# EAGLE design Lemming_SMD_2_2 (EAGLE 9.5.2)
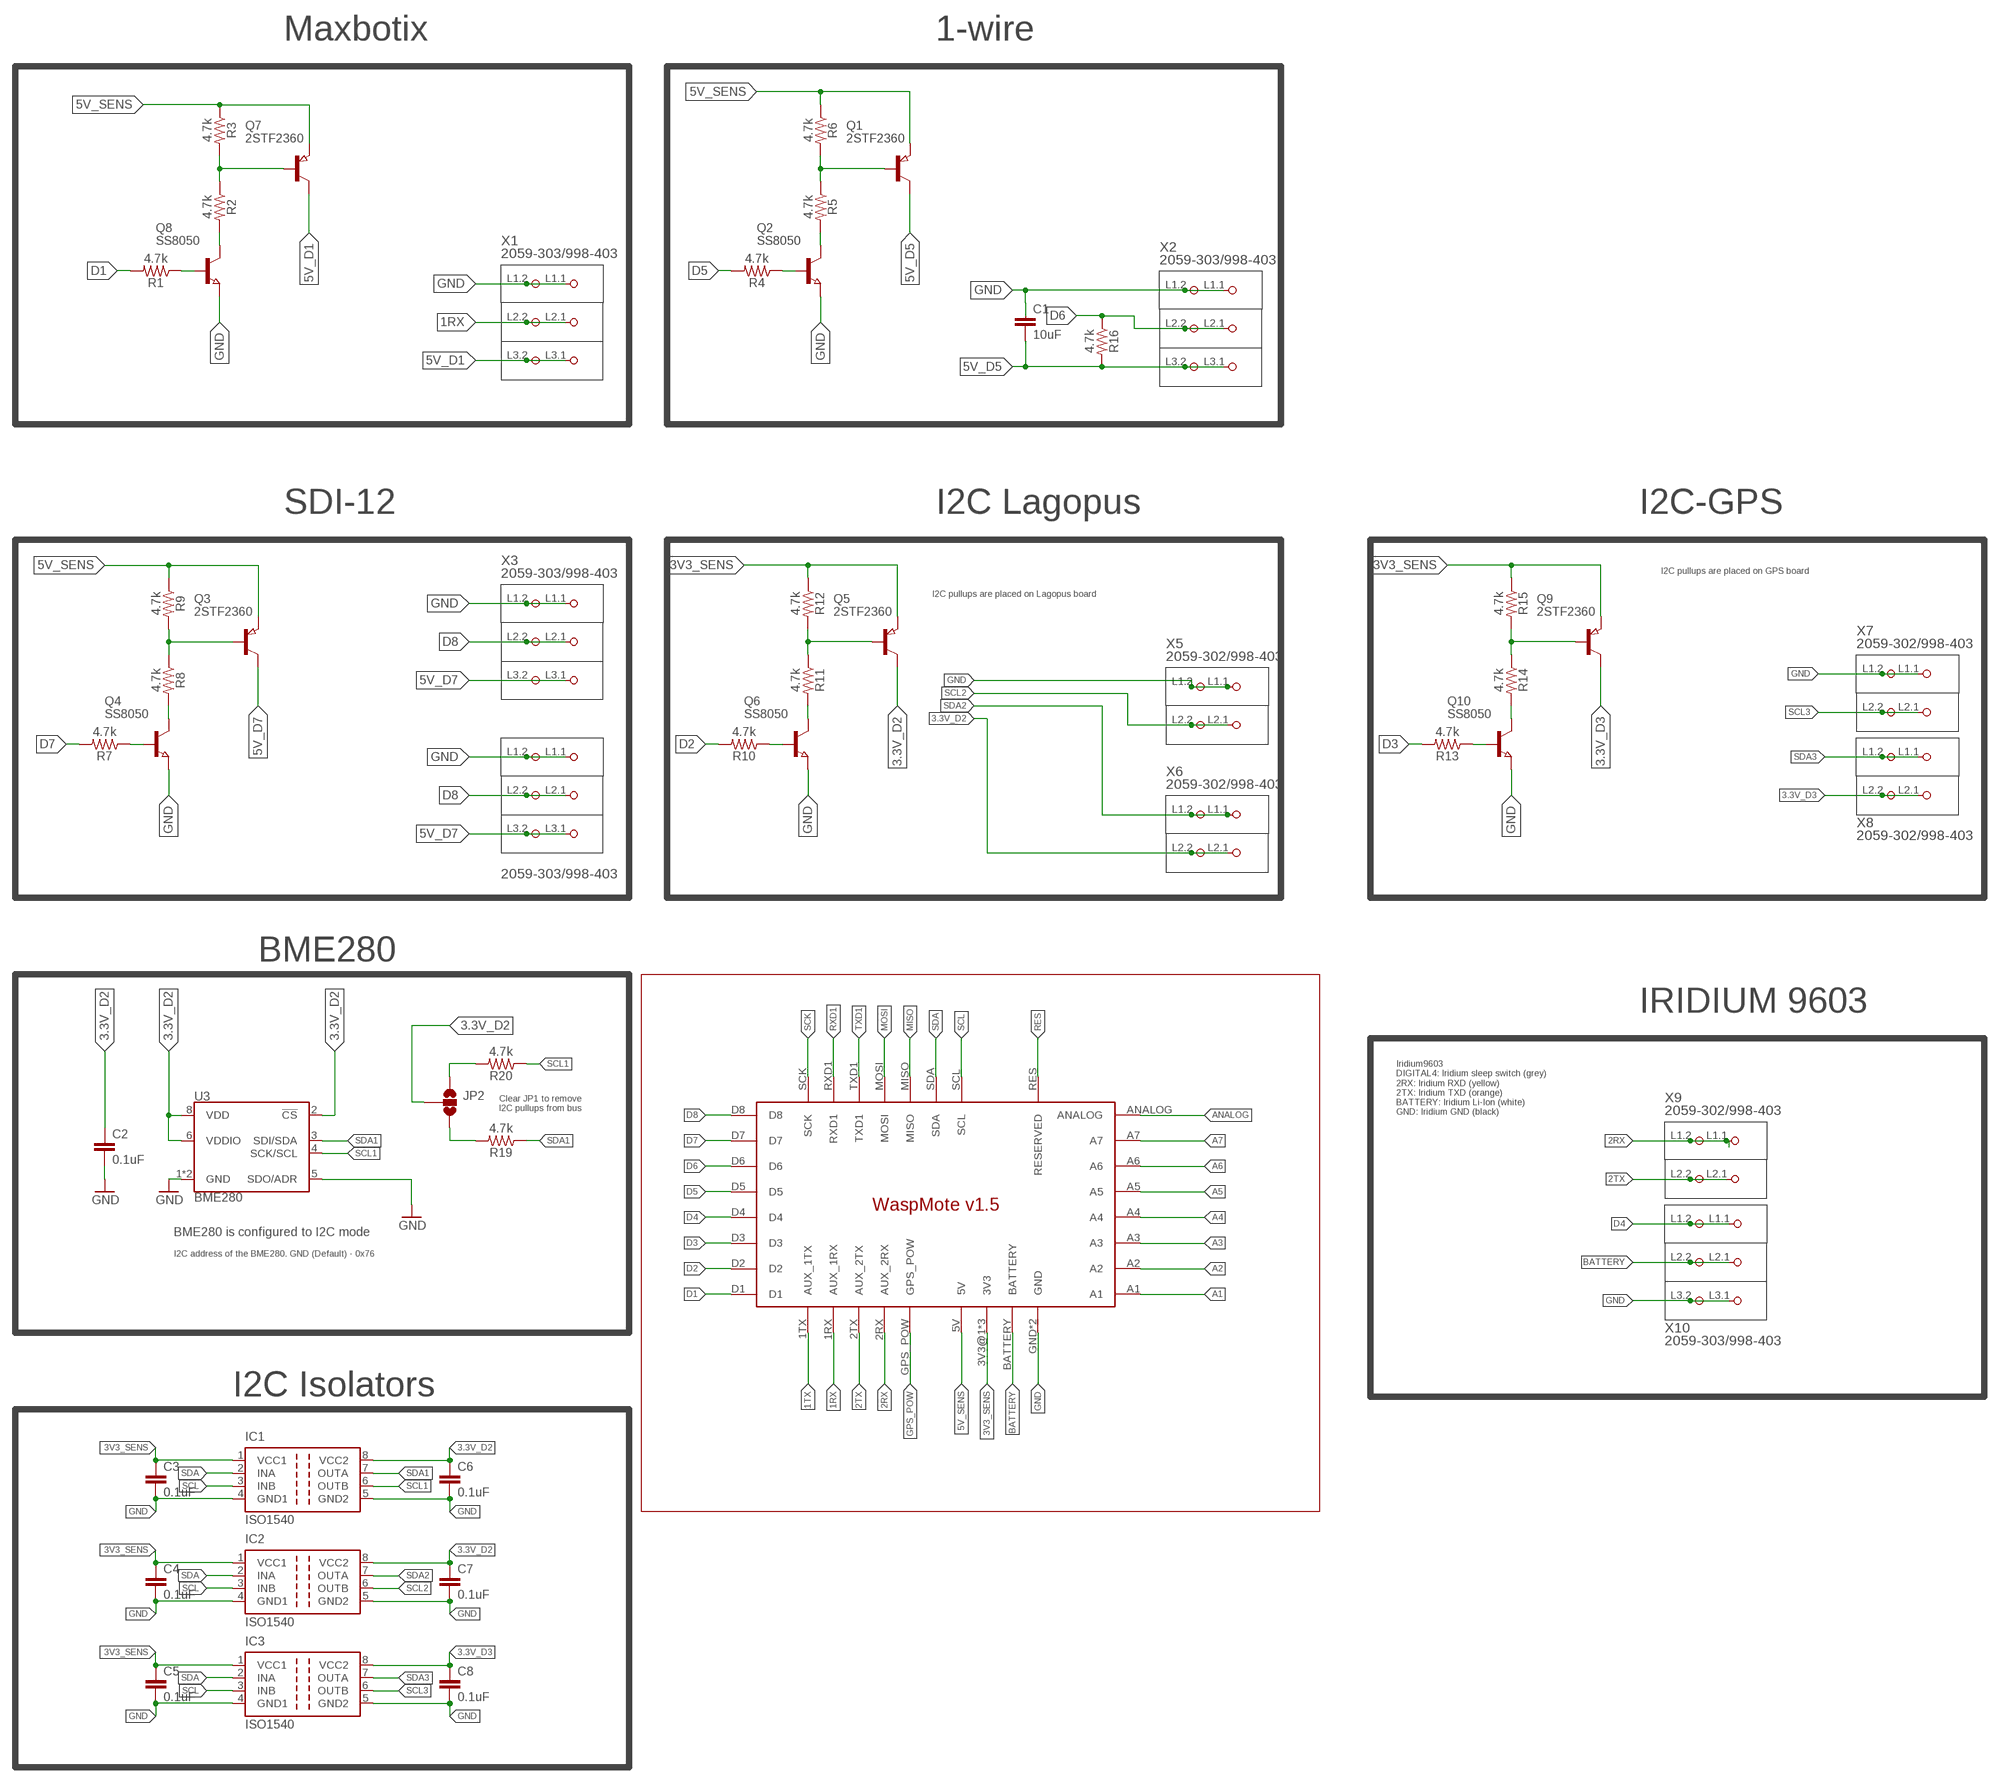
[diagram p0: schematic, sheet 1]

## Parts
C1  10uF  10UF-0603-6.3V-20%  [0603]
C2  0.1uF  0.1UF-0603-25V-(+80/-20%)  [0603]
C3  0.1uF  0.1UF-0603-25V-(+80/-20%)  [0603]
C4  0.1uF  0.1UF-0603-25V-(+80/-20%)  [0603]
C5  0.1uF  0.1UF-0603-25V-(+80/-20%)  [0603]
C6  0.1uF  0.1UF-0603-25V-(+80/-20%)  [0603]
C7  0.1uF  0.1UF-0603-25V-(+80/-20%)  [0603]
C8  0.1uF  0.1UF-0603-25V-(+80/-20%)  [0603]
IC1  ISO1540  ISO7220M  [SO-08]
IC2  ISO1540  ISO7220M  [SO-08]
IC3  ISO1540  ISO7220M  [SO-08]
JP2  JUMPER-SMT_3_NO_SILK  [SMT-JUMPER_3_NO_SILK]
Q1  2STF2360  PNP-TRANSISTOR_SOT89  [SOT89]
Q2  SS8050  NPN-TRANSISTOR_SOT23  [SOT23]
Q3  2STF2360  PNP-TRANSISTOR_SOT89  [SOT89]
Q4  SS8050  NPN-TRANSISTOR_SOT23  [SOT23]
Q5  2STF2360  PNP-TRANSISTOR_SOT89  [SOT89]
Q6  SS8050  NPN-TRANSISTOR_SOT23  [SOT23]
Q7  2STF2360  PNP-TRANSISTOR_SOT89  [SOT89]
Q8  SS8050  NPN-TRANSISTOR_SOT23  [SOT23]
Q9  2STF2360  PNP-TRANSISTOR_SOT89  [SOT89]
Q10  SS8050  NPN-TRANSISTOR_SOT23  [SOT23]
R1  4.7k  4.7KOHM-0603-1/10W-1%  [0603]
R2  4.7k  4.7KOHM-0603-1/10W-1%  [0603]
R3  4.7k  4.7KOHM-0603-1/10W-1%  [0603]
R4  4.7k  4.7KOHM-0603-1/10W-1%  [0603]
R5  4.7k  4.7KOHM-0603-1/10W-1%  [0603]
R6  4.7k  4.7KOHM-0603-1/10W-1%  [0603]
R7  4.7k  4.7KOHM-0603-1/10W-1%  [0603]
R8  4.7k  4.7KOHM-0603-1/10W-1%  [0603]
R9  4.7k  4.7KOHM-0603-1/10W-1%  [0603]
R10  4.7k  4.7KOHM-0603-1/10W-1%  [0603]
R11  4.7k  4.7KOHM-0603-1/10W-1%  [0603]
R12  4.7k  4.7KOHM-0603-1/10W-1%  [0603]
R13  4.7k  4.7KOHM-0603-1/10W-1%  [0603]
R14  4.7k  4.7KOHM-0603-1/10W-1%  [0603]
R15  4.7k  4.7KOHM-0603-1/10W-1%  [0603]
R16  4.7k  4.7KOHM-0603-1/10W-1%  [0603]
R19  4.7k  4.7KOHM-0603-1/10W-1%  [0603]
R20  4.7k  4.7KOHM-0603-1/10W-1%  [0603]
U3  BME280  [LGA-8-2.5X2.5]
U$1  WASPMOTE_V1.5  [WASPMOTE_V1.5]
X1  2059-303/998-403  [P-2059-303/998-403]
X2  2059-303/998-403  [P-2059-303/998-403]
X3  2059-303/998-403  [P-2059-303/998-403]
X4  2059-303/998-403  [P-2059-303/998-403]
X5  2059-302/998-403  [P-2059-302/998-403]
X6  2059-302/998-403  [P-2059-302/998-403]
X7  2059-302/998-403  [P-2059-302/998-403]
X8  2059-302/998-403  [P-2059-302/998-403]
X9  2059-302/998-403  [P-2059-302/998-403]
X10  2059-303/998-403  [P-2059-303/998-403]

## Nets
1RX: U$1.1RX(AUX_1RX) X1.L2.1(P2.1) X1.L2.2(P2.2)
1TX: U$1.1TX(AUX_1TX)
2RX: U$1.2RX(AUX_2RX) X9.L1.1(P1.1) X9.L1.2(P1.2)
2TX: U$1.2TX(AUX_2TX) X9.L2.1(P2.1) X9.L2.2(P2.2)
3.3V_D2: C2.1 C6.1 C7.1 IC1.8(VCC2) IC2.8(VCC2) JP2.2 Q5.2(C) U3.2(!CS) U3.6(VDDIO) U3.8(VDD) X6.L2.1(P2.1) X6.L2.2(P2.2)
3.3V_D3: C8.1 IC3.8(VCC2) Q9.2(C) X8.L2.1(P2.1) X8.L2.2(P2.2)
3V3_SENS: C3.1 C4.1 C5.1 IC1.1(VCC1) IC2.1(VCC1) IC3.1(VCC1) Q5.3(E) Q9.3(E) R12.1 R15.1 U$1.3V3@1(3V3) U$1.3V3@2(3V3) U$1.3V3@3(3V3)
5V_D1: Q7.2(C) X1.L3.1(P3.1) X1.L3.2(P3.2)
5V_D5: C1.2 Q1.2(C) R16.2 X2.L3.1(P3.1) X2.L3.2(P3.2)
5V_D7: Q3.2(C) X3.L3.1(P3.1) X3.L3.2(P3.2) X4.L3.1(P3.1) X4.L3.2(P3.2)
5V_SENS: Q1.3(E) Q3.3(E) Q7.3(E) R3.1 R6.1 R9.1 U$1.5V
A1: U$1.A1
A2: U$1.A2
A3: U$1.A3
A4: U$1.A4
A5: U$1.A5
A6: U$1.A6
A7: U$1.A7
ANALOG: U$1.ANALOG
BATTERY: U$1.BATTERY X10.L2.1(P2.1) X10.L2.2(P2.2)
D1: R1.2 U$1.D1
D2: R10.2 U$1.D2
D3: R13.2 U$1.D3
D4: U$1.D4 X10.L1.1(P1.1) X10.L1.2(P1.2)
D5: R4.2 U$1.D5
D6: R16.1 U$1.D6 X2.L2.1(P2.1) X2.L2.2(P2.2)
D7: R7.2 U$1.D7
D8: U$1.D8 X3.L2.1(P2.1) X3.L2.2(P2.2) X4.L2.1(P2.1) X4.L2.2(P2.2)
GND: C1.1 C2.2 C3.2 C4.2 C5.2 C6.2 C7.2 C8.2 IC1.4(GND1) IC1.5(GND2) IC2.4(GND1) IC2.5(GND2) IC3.4(GND1) IC3.5(GND2) Q2.2(E) Q4.2(E) Q6.2(E) Q8.2(E) Q10.2(E) U3.1(GND) U3.5(SDO/ADR) U3.7(GND) U$1.GND U$1.GND_2(GND) X1.L1.1(P1.1) X1.L1.2(P1.2) X2.L1.1(P1.1) X2.L1.2(P1.2) X3.L1.1(P1.1) X3.L1.2(P1.2) X4.L1.1(P1.1) X4.L1.2(P1.2) X5.L1.1(P1.1) X5.L1.2(P1.2) X7.L1.1(P1.1) X7.L1.2(P1.2) X10.L3.1(P3.1) X10.L3.2(P3.2)
GPS_POW: U$1.GPS_POW
MISO: U$1.MISO
MOSI: U$1.MOSI
N$1: Q6.1(B) R10.1
N$2: Q6.3(C) R11.2
N$3: Q5.1(B) R11.1 R12.2
N$4: Q2.1(B) R4.1
N$5: Q1.1(B) R5.1 R6.2
N$6: Q10.1(B) R13.1
N$7: Q3.1(B) R8.1 R9.2
N$8: Q4.3(C) R8.2
N$9: Q4.1(B) R7.1
N$10: Q8.1(B) R1.1
N$11: Q8.3(C) R2.2
N$12: Q7.1(B) R2.1 R3.2
N$13: Q2.3(C) R5.2
N$14: Q10.3(C) R14.2
N$15: Q9.1(B) R14.1 R15.2
N$18: JP2.3 R19.2
N$19: JP2.1 R20.2
RES: U$1.RES(RESERVED)
RXD1: U$1.RXD1
SCK: U$1.SCK
SCL: IC1.3(INB) IC2.3(INB) IC3.3(INB) U$1.SCL
SCL1: IC1.6(OUTB) R20.1 U3.4(SCK/SCL)
SCL2: IC2.6(OUTB) X5.L2.1(P2.1) X5.L2.2(P2.2)
SCL3: IC3.6(OUTB) X7.L2.1(P2.1) X7.L2.2(P2.2)
SDA: IC1.2(INA) IC2.2(INA) IC3.2(INA) U$1.SDA
SDA1: IC1.7(OUTA) R19.1 U3.3(SDI/SDA)
SDA2: IC2.7(OUTA) X6.L1.1(P1.1) X6.L1.2(P1.2)
SDA3: IC3.7(OUTA) X8.L1.1(P1.1) X8.L1.2(P1.2)
TXD1: U$1.TXD1

## Notes on the sheet
- Maxbotix | 1-wire
- SDI-12 | I2C Lagopus | I2C-GPS
- I2C pullups are placed on GPS board
- I2C pullups are placed on Lagopus board
- BME280
- IRIDIUM 9603
- Clear JP1 to remove
  I2C pullups from bus
- Iridium9603
  DIGITAL4: Iridium sleep switch (grey)
  2RX: Iridium RXD (yellow)
  2TX: Iridium TXD (orange)
  BATTERY: Iridium Li-Ion (white)
  GND: Iridium GND (black)
- BME280 is configured to I2C mode
- I2C address of the BME280. GND (Default) - 0x76
- I2C Isolators

## Library data of the parts
C1 = SparkFun-Capacitors:10UF: 10.0µF ceramic capacitors A capacitor is a passive two-terminal electrical component used to store electrical energy temporarily in an electric field.; PROD_ID: CAP-11015
C2-C8 = SparkFun-Capacitors:0.1UF: 0.1µF ceramic capacitors A capacitor is a passive two-terminal electrical component used to store electrical energy temporarily in an electric field.; PROD_ID: CAP-00810
IC1-IC3 = texas:ISO7220: DUAL DIGITAL ISOLATORS Source: http://focus.ti.com/lit/ds/symlink/iso7221a.pdf; MPN: ISO7220MD; OC_FARNELL: 1390646; OC_NEWARK: 61M6991
JP2 = SparkFun-Jumpers:JUMPER-SMT_3_NO: Normally open jumper This jumper has three pads in close proximity to each other. Apply solder to close the connection(s).
Q1 Q3 Q5 Q7 Q9 = semicon-smd-ipc:PNP-TRANSISTOR_: PNP TRANSISTOR
Q2 Q4 Q6 Q8 Q10 = semicon-smd-ipc:NPN-TRANSISTOR_: NPN TRANSISTOR
R1-R16 R19 R20 = SparkFun-Resistors:4.7KOHM: 4.7kΩ resistor A resistor is a passive two-terminal electrical component that implements electrical resistance as a circuit element. Resistors act to reduce current flow, and, at the same time, act to lower voltage levels within circuits. - Wikipedia; PROD_ID: RES-07857
U3 = SparkFun-Sensors:BME280: Bosch BME280 – Combined Humidity and Pressure Sensor The BME280 is as combined digital humidity, pressure and temperature sensor based on proven sensing principles. The sensor module is housed in an extremely compact metal-lid LGA package with a footprint of only 2.5×2.5mm² with a height of 0.93mm. Its small dimensions and its low power consumption allow the implementation in battery driven devices such as handsets, GPS modules or watches. Datasheet <https://cdn.sparkfun.com/assets/learn_tutorials/4/1/9/BST-BME280_DS001-10.pdf> SparkFun Products SparkFun Atmospheric Sensor Breakout - BME280 <https://www.sparkfun.com/products/13676> (SEN-13676); PROD_ID: IC-13090
U$1 = UIO-John:WASPMOTE_V1.5: WaspMote v1.5 (c) 2017 john.hulth@geo.uio.no
X1-X4 X10 = con-wago_2059:2059-303/998-403: Serie 2059, SMD-Leiterplattenklemme im Gurt 3-polig / Series 2059, SMD Terminal block in tape-and-reel packing 3-pole Polzahl / Pole No.: 3 Rastermaß / Pitch: 3 mm Bemessungsspannung / Rated Voltage: 160 V Nennstrom / Nominal Current: 3 A Leiterquerschnitt / Conductor Size: 0.14 - 0.34 mm2 Anschlusstechnik / Connection Technology: PUSH WIRE® Leitereinführung (zur Platine) / Conductor entry angle (to PCB): 0 ° Farbe / Color: weiß / weiß Stand: 01.01.2014. Die jeweils aktuellen Daten zu diesem Artikel finden Sie in unserem Produktkatalog, den Sie unter www.wago.com einsehen können. As of: 01/01/2014. Please find the newest data for this article in our product catalogue, which can be viewed under www.wago.com.
X5-X9 = con-wago_2059:2059-302/998-403: Serie 2059, SMD-Leiterplattenklemme im Gurt 2-polig / Series 2059, SMD Terminal block in tape-and-reel packing 2-pole Polzahl / Pole No.: 2 Rastermaß / Pitch: 3 mm Bemessungsspannung / Rated Voltage: 160 V Nennstrom / Nominal Current: 3 A Leiterquerschnitt / Conductor Size: 0.14 - 0.34 mm2 Anschlusstechnik / Connection Technology: PUSH WIRE® Leitereinführung (zur Platine) / Conductor entry angle (to PCB): 0 ° Farbe / Color: weiß / weiß Stand: 01.01.2014. Die jeweils aktuellen Daten zu diesem Artikel finden Sie in unserem Produktkatalog, den Sie unter www.wago.com einsehen können. As of: 01/01/2014. Please find the newest data for this article in our product catalogue, which can be viewed under www.wago.com.

## Net classes
1 vcc: width 0.178 mm

## Board
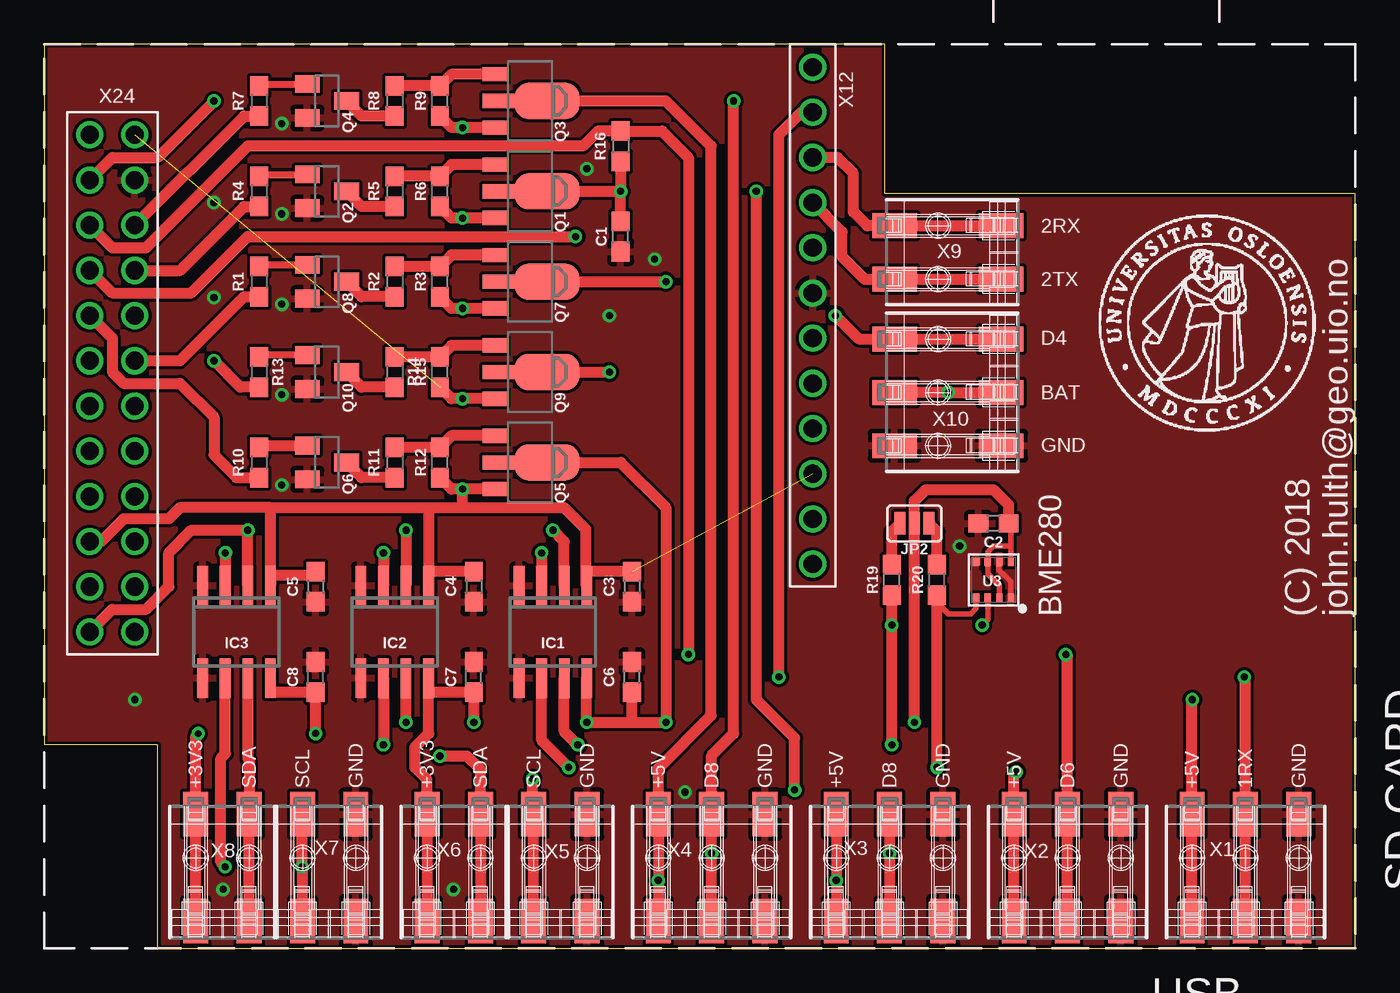
[diagram p1: board, top side]
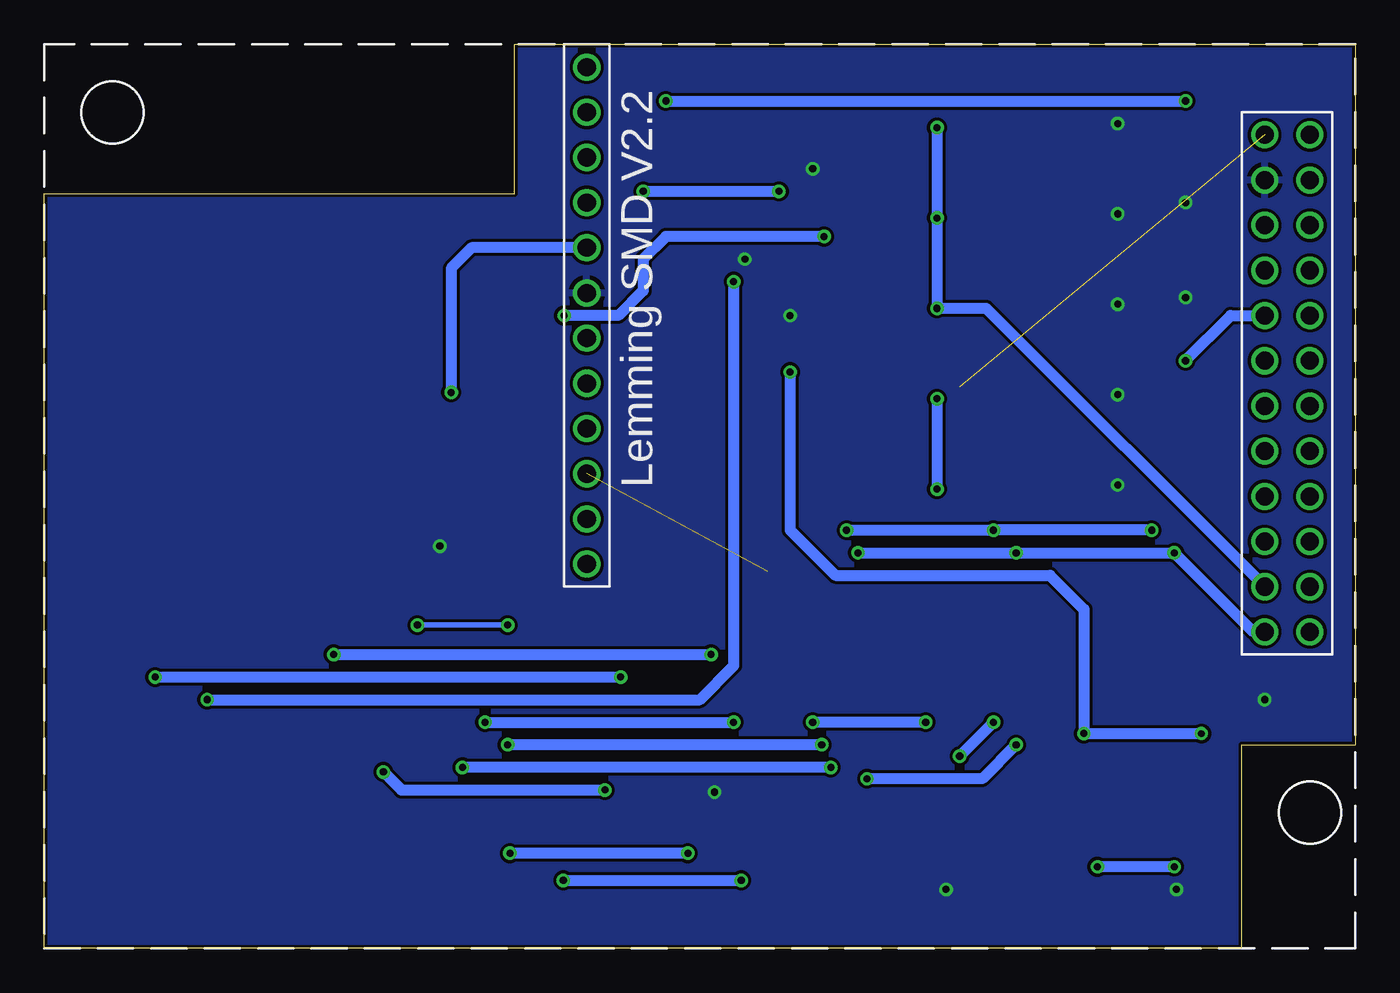
[diagram p2: board, bottom side, seen from below]

Size 73.66 x 50.8 mm. Coordinates in mm from the lower left corner, seen from the top.
Outline: 6.35,0 73.66,0 73.66,42.42 47.24,42.42 47.24,50.8 0,50.8 0,11.43 6.35,11.43 6.35,0
Copper layers (1*16): Top 0.035mm / dielectric 1.5mm / Bottom 0.035mm
Design rules "SparkFun-2-layer-TIGHT": minimum track width 7mil, minimum drill 15mil, track to track 7mil, track to pad 7mil, pad to pad 7mil, via to via 7mil, smd to smd 7mil, copper to edge 7mil, drill to drill 7mil, minimum pad ring 7mil, minimum via ring 7mil, stop-mask expansion 4mil, vias tented up to drill 25mil, thermal gap 10mil

### Footprints (pad centres in the part's own frame; a part is rotated, then mirrored left to right if it is on the bottom)
0603 = smd 1.1 x 1: 1 -0.85,0; 2 0.85,0
SO-08 = smd 0.6 x 2.2: 1 -1.905,-2.6; 2 -0.635,-2.6; 3 0.635,-2.6; 4 1.905,-2.6; 5 1.905,2.6; 6 0.635,2.6; 7 -0.635,2.6; 8 -1.905,2.6
SMT-JUMPER_3_NO_SILK = smd 0.635 x 1.27: 1 -0.813,0; 2 0,0; 3 0.813,0
SOT89 = smd 0.8 x 1.4: 1 -1.499,-1.981; 3 1.499,-1.981 | smd 0.8 x 1.9: 2 0,-1.727 | smd 2.032 x 3.65: 2@1 0,0.94
SOT23 = smd 1 x 1.4: 1 -0.95,-1.1; 2 0.95,-1.1; 3 0,1.1
LGA-8-2.5X2.5 = smd 0.35 x 0.5: 1 -0.975,1.025; 2 -0.325,1.025; 3 0.325,1.025; 4 0.975,1.025; 5 0.975,-1.025; 6 0.325,-1.025; 7 -0.325,-1.025; 8 -0.975,-1.025
WASPMOTE_V1.5 = drill 1.016: 1RX 43.18,46.99; 1TX 43.18,49.53; 2RX 43.18,44.45; 2TX 43.18,41.91; 3V3@1 5.08,45.72; 3V3@2 2.54,22.86; 3V3@3 43.18,26.67; 5V 5.08,20.32; A1 5.08,22.86; A2 2.54,25.4; A3 5.08,25.4; A4 2.54,27.94; A5 5.08,27.94; A6 2.54,30.48; A7 5.08,30.48; ANALOG 2.54,45.72; BATTERY 43.18,39.37; D1 5.08,33.02; D2 2.54,35.56; D3 5.08,35.56; D4 2.54,38.1; D5 5.08,38.1; D6 2.54,40.64; D7 5.08,40.64; D8 2.54,43.18; GND 5.08,43.18; GND_2 43.18,36.83; GPS_POW 2.54,20.32; MISO 43.18,21.59; MOSI 43.18,24.13; RES 2.54,33.02; RXD1 43.18,31.75; SCK 43.18,34.29; SCL 5.08,17.78; SDA 2.54,17.78; TXD1 43.18,29.21
P-2059-303/998-403 = smd 2.5 x 1.4: L1.1 2.975,3; L1.2 -3.025,3; L2.1 2.975,0; L2.2 -3.025,0; L3.1 2.975,-3; L3.2 -3.025,-3
P-2059-302/998-403 = smd 2.5 x 1.4: L1.1 2.975,1.5; L1.2 -3.025,1.5; L2.1 2.975,-1.5; L2.2 -3.025,-1.5

### Placement (x,y rotation side)
C1  32.38,40.01 90 top
C2  53.34,23.88 180 top
C3  33.02,20.32 270 top
C4  24.13,20.32 270 top
C5  15.24,20.32 270 top
C6  33.02,15.24 90 top
C7  24.13,15.24 90 top
C8  15.24,15.24 90 top
IC1  28.57,17.78 180 top
IC2  19.68,17.78 180 top
IC3  10.79,17.78 180 top
JP2  48.9,23.88 180 top
Q1  27.3,42.55 270 top
Q2  15.88,42.55 270 top
Q3  27.3,47.62 270 top
Q4  15.88,47.62 270 top
Q5  27.3,27.3 270 top
Q6  15.88,27.3 270 top
Q7  27.3,37.47 270 top
Q8  15.88,37.47 270 top
Q9  27.3,32.38 270 top
Q10  15.88,32.38 270 top
R1  12.06,37.47 270 top
R2  19.68,37.47 270 top
R3  22.23,37.47 90 top
R4  12.06,42.55 270 top
R5  19.68,42.55 270 top
R6  22.23,42.55 90 top
R7  12.06,47.62 270 top
R8  19.68,47.62 270 top
R9  22.23,47.62 90 top
R10  12.06,27.3 270 top
R11  19.68,27.3 270 top
R12  22.23,27.3 90 top
R13  12.06,32.38 270 top
R14  19.68,32.38 270 top
R15  22.23,32.38 90 top
R16  32.38,45.09 270 top
R19  47.62,20.7 90 top
R20  50.16,20.7 90 top
U3  53.34,20.7 180 top
U$1  0,0 0 top
U$3  [UIO-LOGO-BL]  59.02,28.8 0 top
X1  67.5,4.5 270 top
X2  57.5,4.5 270 top
X3  47.5,4.5 270 top
X4  37.5,4.5 270 top
X5  29,4.5 270 top
X6  23,4.5 270 top
X7  16,4.5 270 top
X8  10,4.5 270 top
X9  50.8,39.12 0 top
X10  50.8,31.24 0 top

### Tracks (layer width: path | path; a pad name or v marks a point on that pad's centre or on a via)
1RX  (via drill 0.4)
  Top 0.61: v41.27,15.24 41.27,45.72 42.55,46.99 U$1.1RX | X1.L2.1 X1.L2.2 67.5,15.18 v67.44,15.24
  Bottom 0.61: v67.44,15.24 v41.27,15.24
2RX
  Top 0.61: U$1.2RX 44.58,44.45 45.47,43.56 45.47,41.4 46.25,40.62 X9.L1.2 X9.L1.1
2TX
  Top 0.61: U$1.2TX 44.83,40.26 44.83,38.86 46.1,37.59 47.75,37.59 X9.L2.2 X9.L2.1
3.3V_D2  (via drill 0.4)
  Top 0.305: U3.2 53.66,20.38 53.02,21.03 U3.6 53.02,22.28 53.34,22.61 54.31,22.61 | C2.1 54.31,23.75 54.31,22.61 | U3.8 54.31,22.61
  Top 0.61: 21.59,14.61 21.8,14.39 C7.1 v24.13,12.7 | 21.59,14.61 21.59,12.06 20.83,11.3 20.83,10.16 21.5,9.49 X6.L2.2 X6.L2.1 | 33.02,12.7 v30.48,12.7 IC1.8 | 33.02,12.7 v34.92,12.7 34.92,24.77 32.38,27.3 Q5.2 | 33.02,12.7 C6.1 | C2.1 54.19,24.93 53.34,25.78 49.53,25.78 48.9,25.15 JP2.2 v48.9,12.7 | IC2.8 21.59,14.61
  Bottom 0.61: v24.13,12.7 v30.48,12.7 | v48.9,12.7 v34.92,12.7
3.3V_D3  (via drill 0.38, 0.4)
  Top 0.61: Q9.2 v31.75,32.38 | IC3.8 12.7,14.61 12.91,14.39 C8.1 v15.24,12.06 | X8.L2.1 X8.L2.2 8.5,11.93 v8.64,12.06
  Bottom 0.61: v31.75,32.38 31.75,23.5 29.21,20.95 17.14,20.95 15.24,19.05 v15.24,12.06 v8.64,12.06
3V3_SENS  (via drill 0.4)  (2 unrouted)
  Top 0.61: Q5.3 v23.5,25.81 | v23.5,25.81 22.87,25.81 R12.1 | Q9.3 v23.5,30.89 22.87,30.89 R15.1 | 12.7,24.77 21.59,24.77 | 21.59,24.77 23.5,24.77 | 23.5,24.77 v23.5,25.81 | 23.5,24.77 29.21,24.77 30.42,23.55 30.42,20.95 | 30.42,20.95 30.42,20.44 IC1.1 | 21.59,24.77 21.59,20.95 | 21.59,20.95 IC2.1 | 12.7,20.95 12.7,24.77 | 12.7,20.95 IC3.1 | C5.1 15.03,20.95 12.7,20.95 | C4.1 21.8,21.17 21.59,20.95 | C3.1 30.64,21.17 30.42,20.95 | 12.7,24.77 7.62,24.77 6.99,24.13 4.45,24.13 3.17,22.86 U$1.3V3@2
  Bottom 0.61: v23.5,30.89 v23.5,25.81
5V_D1  (via drill 0.4)
  Top 0.61: Q7.2 v34.92,37.47 | X1.L3.1 X1.L3.2 64.5,13.95 v64.52,13.97
  Bottom 0.61: v64.52,13.97 36.83,13.97 34.92,15.88 v34.92,37.47
5V_D5  (via drill 0.4)
  Top 0.61: Q1.2 v32.38,42.55 | R16.2 v32.38,42.55 | v40.01,42.55 40.01,13.97 42.16,11.81 v42.16,8.89 | C1.2 v32.38,42.55 | X2.L3.1 X2.L3.2 54.5,9.8 v54.61,9.91
  Bottom 0.61: v40.01,42.55 v32.38,42.55 | v54.61,9.91 53.59,8.89 v42.16,8.89
5V_D7  (via drill 0.4)
  Top 0.61: Q3.2 34.92,47.62 37.47,45.09 37.47,13.08 34.5,10.12 X4.L3.2 v34.5,3.81 X4.L3.1 | X3.L3.2 v44.5,3.81 X3.L3.1
  Bottom 0.61: v44.5,3.81 v34.5,3.81
5V_SENS  (via drill 0.4)
  Top 0.61: Q3.3 v23.5,46.13 22.87,46.13 R9.1 | Q1.3 v23.5,41.05 22.87,41.05 R6.1 | Q7.3 v23.5,35.97 22.87,35.97 R3.1
  Bottom 0.61: v23.5,46.13 v23.5,41.05 v23.5,35.97 20.73,35.97 U$1.5V
BATTERY  (via drill 0.4)
  Top 0.61: X10.L2.2 v50.8,31.24 X10.L2.1
  Bottom 0.61: U$1.BATTERY 49.66,39.37 50.8,38.23 v50.8,31.24
D1
  Top 0.61: U$1.D1 7.62,33.02 11.21,36.62 R1.2
D2
  Top 0.61: U$1.D2 3.81,34.29 3.81,32.38 4.45,31.75 7.62,31.75 9.53,29.84 9.53,27.73 10.79,26.45 R10.2
D3  (via drill 0.4)
  Top 0.61: R13.2 11.01,31.54 v9.53,33.02
  Bottom 0.61: v9.53,33.02 6.99,35.56 U$1.D3
D4  (via drill 0.4)
  Top 0.61: U$1.D4 3.81,36.83 8.26,36.83 11.43,40.01 v29.84,40.01 | v44.45,35.56 45.77,34.24 X10.L1.2 X10.L1.1
  Bottom 0.61: v29.84,40.01 38.73,40.01 40.01,38.73 40.01,36.96 41.4,35.56 v44.45,35.56
D5
  Top 0.61: U$1.D5 7.62,38.1 11.21,41.7 R4.2
D6  (via drill 0.4)
  Top 0.61: U$1.D6 3.81,39.37 5.71,39.37 11.43,45.09 30.27,45.09 31.11,45.94 R16.1 34.71,45.94 36.2,44.45 v36.2,16.51 | X2.L2.1 X2.L2.2 57.5,16.41 v57.4,16.51
  Bottom 0.61: v57.4,16.51 v36.2,16.51
D7
  Top 0.61: U$1.D7 11.21,46.77 R7.2
D8  (via drill 0.4)
  Top 0.61: U$1.D8 3.81,44.45 6.35,44.45 v9.53,47.62 | v38.73,47.62 38.73,12.06 37.5,10.83 X4.L2.2 v37.5,5.33 X4.L2.1 | X3.L2.2 v47.5,5.33 X3.L2.1
  Bottom 0.61: v38.73,47.62 v9.53,47.62 | v37.5,5.33 v47.5,5.33
GND  (via drill 0.4)
  Top 0.305: U3.1 54.31,20.61 53.66,21.27 53.66,21.72 U3.7
  other vias: 13.34,46.35 13.34,41.27 13.34,36.2 13.34,31.11 13.34,26.04 9.53,41.91 30.48,43.81 34.29,38.73 51.44,22.61 31.75,35.56 5.08,13.97 36,8.78 10.03,3.3 22.99,3.3 9.53,36.58
  pour Bottom: 0,57.28 91.47,57.28 91.47,-10.55 0,-10.55
  pour Top: 0,56.26 0,-9.33 89.84,-9.33 89.84,56.26
N$1
  Top 0.61: R10.1 12.16,28.25 Q6.1
N$2
  Top 0.61: R11.2 17.82,26.45 Q6.3
N$3
  Top 0.61: Q5.1 22.87,28.8 R12.2 R11.1
N$4
  Top 0.406: R4.1 12.16,43.49 Q2.1
N$5
  Top 0.61: Q1.1 22.87,44.04 R6.2 R5.1
N$6
  Top 0.406: Q10.1 12.16,33.34
  Top 0.61: 12.16,33.34 R13.1
N$7
  Top 0.61: Q3.1 22.87,49.12 R9.2 R8.1
N$8
  Top 0.61: R8.2 17.82,46.77 Q4.3
N$9
  Top 0.406: R7.1 12.16,48.58 Q4.1
N$10
  Top 0.406: R1.1 12.16,38.41 Q8.1
N$11
  Top 0.61: R2.2 17.82,36.62 Q8.3
N$12
  Top 0.61: Q7.1 22.87,38.96 R3.2 R2.1
N$13
  Top 0.61: R5.2 17.82,41.7 Q2.3
N$14
  Top 0.61: R14.2 17.82,31.54 Q10.3
N$15
  Top 0.61: Q9.1 22.87,33.88 R15.2 R14.1
N$18
  Top 0.61: R19.2 47.62,23.42 JP2.3
N$19
  Top 0.61: R20.2 50.16,23.42 JP2.1
SCL  (via drill 0.4)
  Top 0.61: v10.16,22.23 IC3.3 | v19.05,22.23 IC2.3 | v27.94,22.23 IC1.3
  Bottom 0.61: U$1.SCL 5.71,17.78 v10.16,22.23 v19.05,22.23 v27.94,22.23
SCL1  (via drill 0.4)
  Top 0.305: U3.4 52.37,19.09 52.07,18.8 50.8,18.8 50.16,19.43
  Top 0.61: v50.16,10.16 50.16,19.43 R20.1 | v29.46,10.16 27.94,11.68 IC1.6
  Bottom 0.61: v29.46,10.16 v50.16,10.16
SCL2  (via drill 0.38, 0.4)
  Top 0.61: IC2.6 v19.05,11.43 | X5.L2.1 X5.L2.2 27.43,7.59 v27.43,9.53
  Bottom 0.61: v19.05,11.43 20.95,9.53 v27.43,9.53
SCL3  (via drill 0.38, 0.4)
  Top 0.61: IC3.6 10.16,10.92 9.91,10.67 9.91,4.83 v10.16,4.57 | X7.L2.2 14.22,7.57 14.48,7.32 v14.48,4.57 14.48,1.55 X7.L2.1
  Bottom 0.61: v10.16,4.57 v14.48,4.57
SDA  (via drill 0.4)
  Top 0.61: U$1.SDA 3.81,19.05 5.71,19.05 6.99,20.32 6.99,22.23 8.26,23.5 v11.43,23.5 IC3.2 | v20.32,23.5 IC2.2 | IC1.2 29.21,22.86 v28.57,23.5
  Bottom 0.61: v11.43,23.5 v20.32,23.5 v28.57,23.5
SDA1  (via drill 0.4)
  Top 0.305: U3.3 53.02,18.47 v52.7,18.16
  Top 0.61: v47.62,11.43 v47.62,18.16 R19.1 | v29.97,11.43 29.21,12.19 IC1.7
  Bottom 0.305: v52.7,18.16 v47.62,18.16
  Bottom 0.61: v29.97,11.43 v47.62,11.43
SDA2  (via drill 0.4)
  Top 0.61: v20.32,12.7 IC2.7 | X6.L1.1 X6.L1.2 24.5,10.04 23.75,10.79 v22.23,10.79
  Bottom 0.61: v22.23,10.79 v20.32,12.7
SDA3
  Top 0.61: X8.L1.1 X8.L1.2 11.5,10.6 11.43,10.67 IC3.7

### Text on the board
tNames: X24 | X12 | 2RX | 2TX | D4 | BAT | GND | (C) 2018 / john.hulth@geo.uio.no | +3V3 | SDA | SCL | GND | +3V3 | SDA | SCL | GND | +5V | D8 | GND | +5V | D8 | GND | +5V | D6 | GND | +5V | 1RX | GND
bNames: Lemming SMD V2.2